# EAGLE design escape_uno (EAGLE 9.5.1)
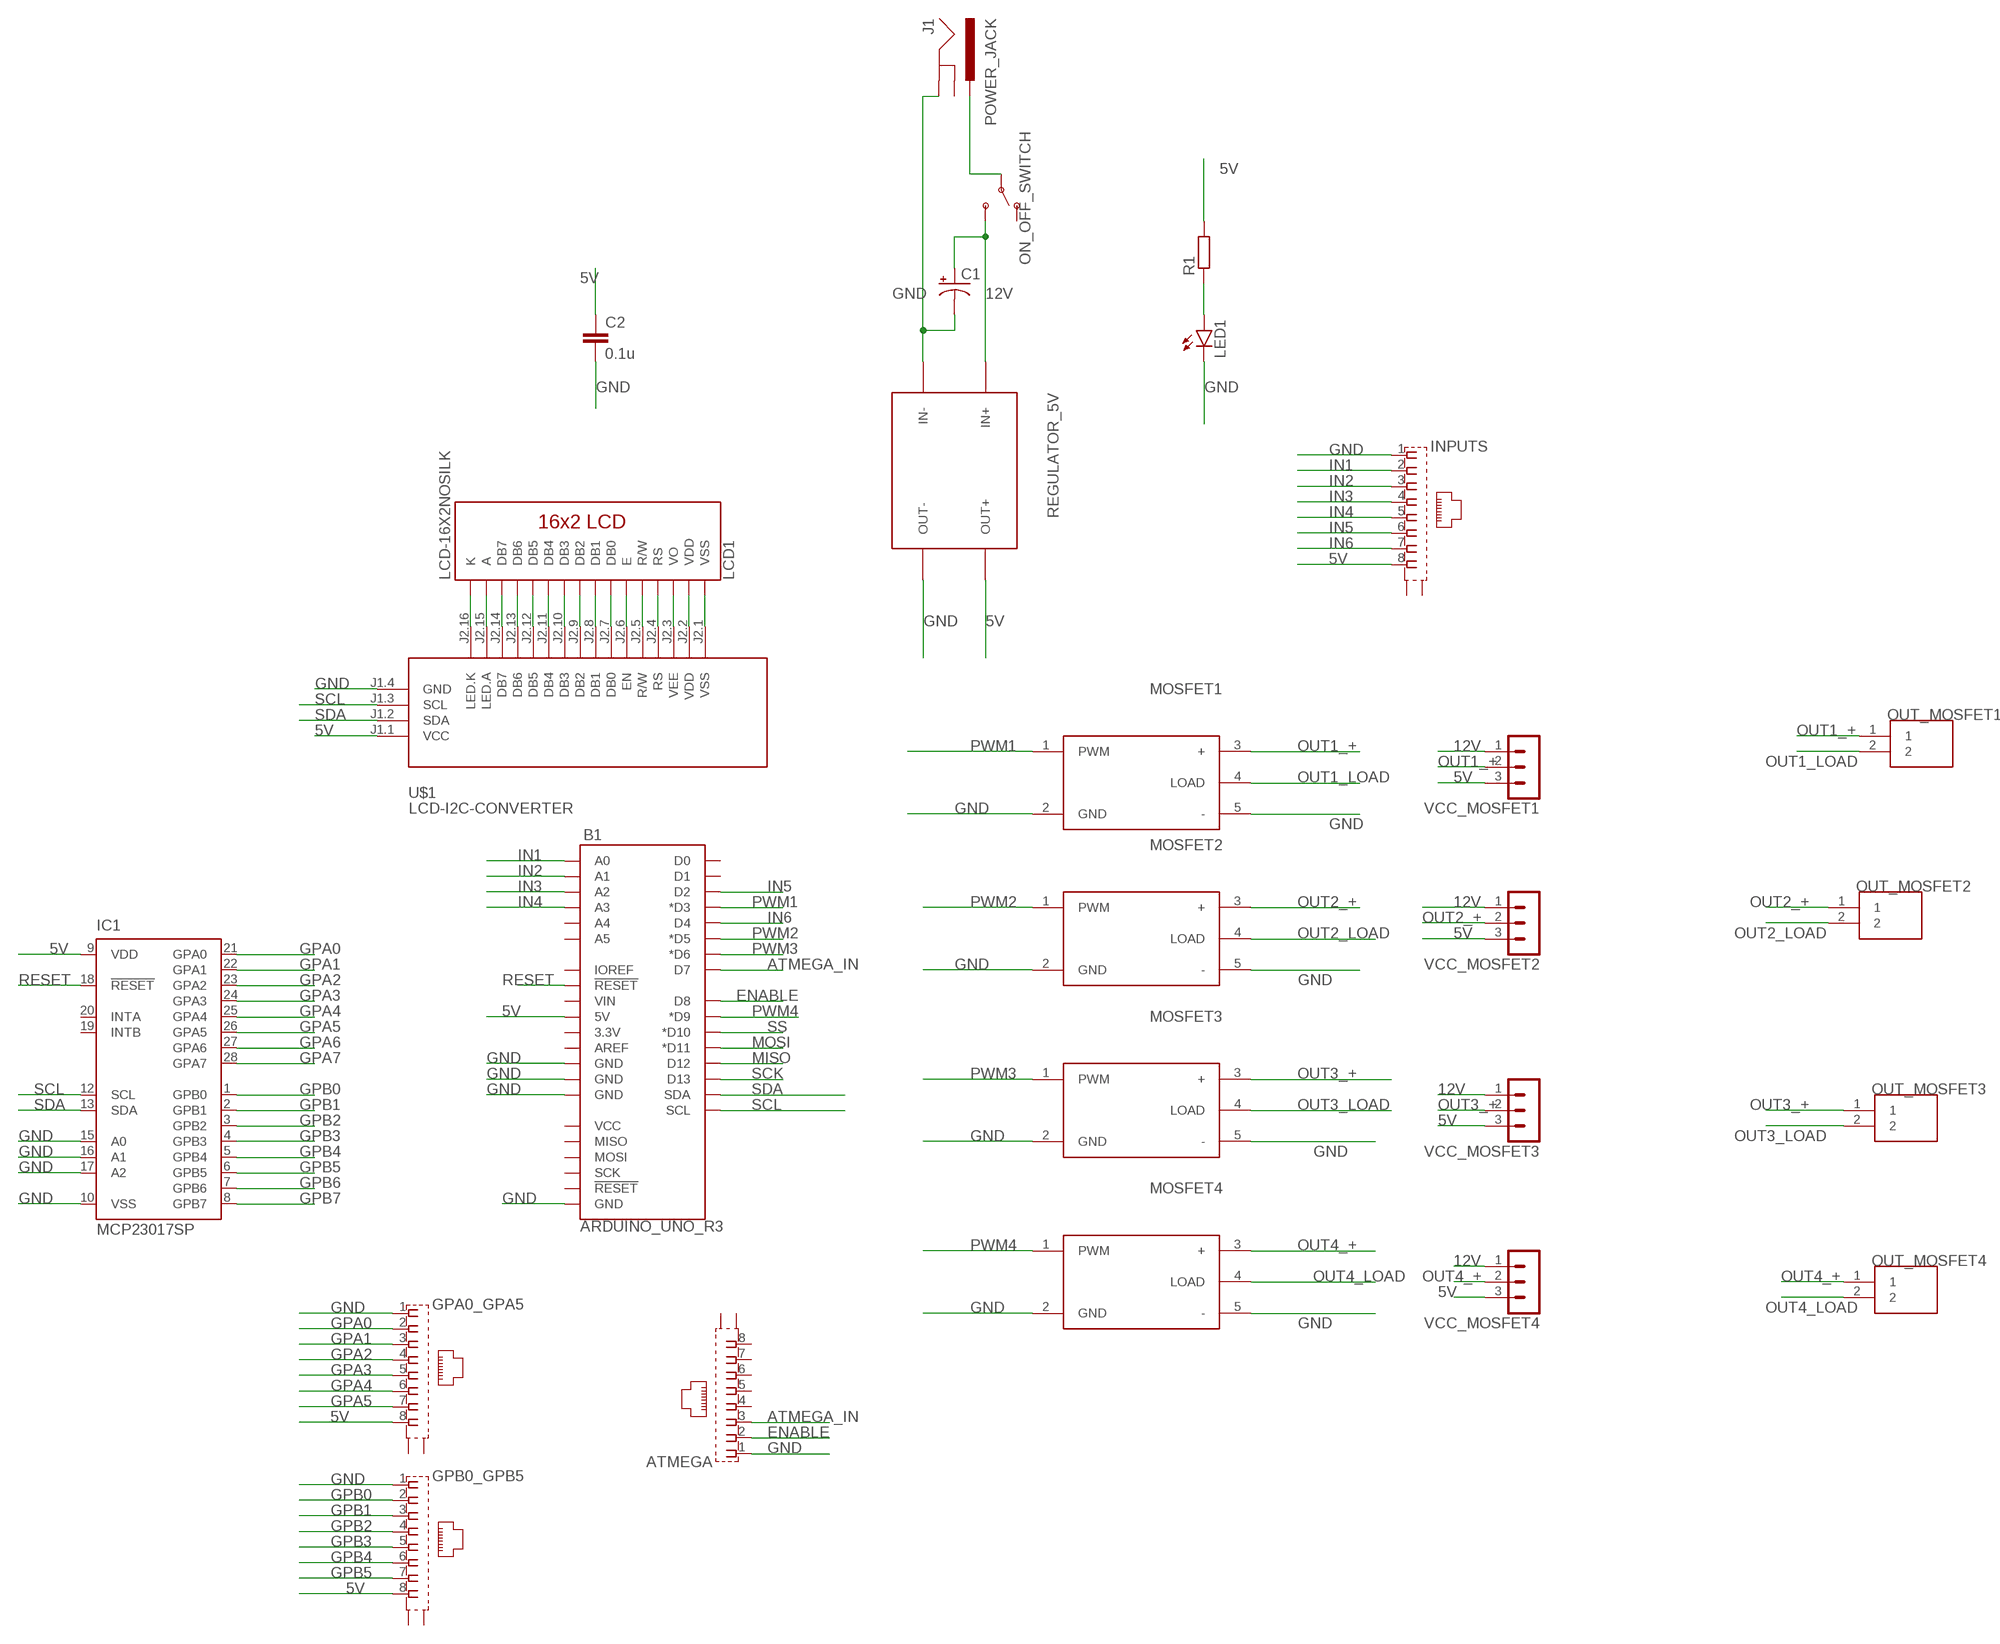
[diagram p0: schematic, sheet 1]

## Parts
ATMEGA  GLX-S-88M  [GLX-S-88M]
B1  ARDUINO_UNO_R3  [ARDUINO_R3]
C1  CPOL-USB45181C  [B45181C]
C2  0.1u  C-EU025-025X050  [C025-025X050]
GPA0_GPA5  GLX-S-88M  [GLX-S-88M]
GPB0_GPB5  GLX-S-88M  [GLX-S-88M]
IC1  MCP23017SP  [DIL28-3]
INPUTS  GLX-S-88M  [GLX-S-88M]
J1  POWER_JACK  [POWER_JACK_PTH]
LCD1  LCD-16X2NOSILK  [LCD-16X2_NOSILK]
LED1  LED5MM  [LED5MM]
MOSFET1  SAMACSYS_PARTS_FR120N-ISOLATED-MOSFET-MOD  [SAMACSYS_PARTS_FR120N-ISOLATED-MOSFET-MOD]
MOSFET2  SAMACSYS_PARTS_FR120N-ISOLATED-MOSFET-MOD  [SAMACSYS_PARTS_FR120N-ISOLATED-MOSFET-MOD]
MOSFET3  SAMACSYS_PARTS_FR120N-ISOLATED-MOSFET-MOD  [SAMACSYS_PARTS_FR120N-ISOLATED-MOSFET-MOD]
MOSFET4  SAMACSYS_PARTS_FR120N-ISOLATED-MOSFET-MOD  [SAMACSYS_PARTS_FR120N-ISOLATED-MOSFET-MOD]
ON_OFF_SWITCH  SWITCH-SPDT-PTH-11.6X4.0MM-SHORT_LEADS  [SWITCH_SPDT_PTH_11.6X4.0MM]
OUT_MOSFET1  TB006-508-02BE_TB006-508-02BE  [TB006-508-02BE_CUI_TB006-508-02BE]
OUT_MOSFET2  TB006-508-02BE_TB006-508-02BE  [TB006-508-02BE_CUI_TB006-508-02BE]
OUT_MOSFET3  TB006-508-02BE_TB006-508-02BE  [TB006-508-02BE_CUI_TB006-508-02BE]
OUT_MOSFET4  TB006-508-02BE_TB006-508-02BE  [TB006-508-02BE_CUI_TB006-508-02BE]
R1  R-EU_0207/10  [0207/10]
REGULATOR_5V  DIY-MODULES_DC-DC-STEP-DOWN-LM2596  [DIY-MODULES_DC-DC-STEP-DOWN-LM2596]
U$1  LCD-I2C-CONVERTER  [LCD-I2C-CONVERTER]
VCC_MOSFET1  MA03-1  [MA03-1]
VCC_MOSFET2  MA03-1  [MA03-1]
VCC_MOSFET3  MA03-1  [MA03-1]
VCC_MOSFET4  MA03-1  [MA03-1]

## Nets
5V: B1.5V C2.1 GPA0_GPA5.8 GPB0_GPB5.8 IC1.9(VDD) INPUTS.8 R1.2 REGULATOR_5V.OUT+ U$1.J1.1(VCC) VCC_MOSFET1.3 VCC_MOSFET2.3 VCC_MOSFET3.3 VCC_MOSFET4.3
12V: C1.+ ON_OFF_SWITCH.3(S) REGULATOR_5V.IN+ VCC_MOSFET1.1 VCC_MOSFET2.1 VCC_MOSFET3.1 VCC_MOSFET4.1
ATMEGA_IN: ATMEGA.3 B1.D7
ENABLE: ATMEGA.2 B1.D8
GND: ATMEGA.1 B1.GND@1(GND) B1.GND@2(GND) B1.GND@3(GND) B1.GND@4(GND) C1.- C2.2 GPA0_GPA5.1 GPB0_GPB5.1 IC1.10(VSS) IC1.15(A0) IC1.16(A1) IC1.17(A2) INPUTS.1 J1.GND LED1.K(C) MOSFET1.2(GND) MOSFET1.5(-) MOSFET2.2(GND) MOSFET2.5(-) MOSFET3.2(GND) MOSFET3.5(-) MOSFET4.2(GND) MOSFET4.5(-) REGULATOR_5V.IN- REGULATOR_5V.OUT- U$1.J1.4(GND)
GPA0: GPA0_GPA5.2 IC1.21(GPA0)
GPA1: GPA0_GPA5.3 IC1.22(GPA1)
GPA2: GPA0_GPA5.4 IC1.23(GPA2)
GPA3: GPA0_GPA5.5 IC1.24(GPA3)
GPA4: GPA0_GPA5.6 IC1.25(GPA4)
GPA5: GPA0_GPA5.7 IC1.26(GPA5)
GPA6: IC1.27(GPA6)
GPA7: IC1.28(GPA7)
GPB0: GPB0_GPB5.2 IC1.1(GPB0)
GPB1: GPB0_GPB5.3 IC1.2(GPB1)
GPB2: GPB0_GPB5.4 IC1.3(GPB2)
GPB3: GPB0_GPB5.5 IC1.4(GPB3)
GPB4: GPB0_GPB5.6 IC1.5(GPB4)
GPB5: GPB0_GPB5.7 IC1.6(GPB5)
GPB6: IC1.7(GPB6)
GPB7: IC1.8(GPB7)
IN1: B1.A0 INPUTS.2
IN2: B1.A1 INPUTS.3
IN3: B1.A2 INPUTS.4
IN4: B1.A3 INPUTS.5
IN5: B1.D2 INPUTS.6
IN6: B1.D4 INPUTS.7
MISO: B1.D12
MOSI: B1.D11(*D11)
N$1: J1.PWR ON_OFF_SWITCH.2(P)
N$2: LED1.A R1.1
N$11: LCD1.16(K) U$1.J2.16(LED.K)
N$12: LCD1.15(A) U$1.J2.15(LED.A)
N$13: LCD1.14(DB7) U$1.J2.14(DB7)
N$14: LCD1.13(DB6) U$1.J2.13(DB6)
N$24: LCD1.12(DB5) U$1.J2.12(DB5)
N$25: LCD1.11(DB4) U$1.J2.11(DB4)
N$26: LCD1.10(DB3) U$1.J2.10(DB3)
N$27: LCD1.9(DB2) U$1.J2.9(DB2)
N$28: LCD1.8(DB1) U$1.J2.8(DB1)
N$29: LCD1.7(DB0) U$1.J2.7(DB0)
N$30: LCD1.6(E) U$1.J2.6(EN)
N$31: LCD1.5(R/W) U$1.J2.5(R/W)
N$32: LCD1.4(RS) U$1.J2.4(RS)
N$33: LCD1.3(VO) U$1.J2.3(VEE)
N$34: LCD1.2(VDD) U$1.J2.2(VDD)
N$35: LCD1.1(VSS) U$1.J2.1(VSS)
OUT1_+: MOSFET1.3(+) OUT_MOSFET1.1 VCC_MOSFET1.2
OUT1_LOAD: MOSFET1.4(LOAD) OUT_MOSFET1.2
OUT2_+: MOSFET2.3(+) OUT_MOSFET2.1 VCC_MOSFET2.2
OUT2_LOAD: MOSFET2.4(LOAD) OUT_MOSFET2.2
OUT3_+: MOSFET3.3(+) OUT_MOSFET3.1 VCC_MOSFET3.2
OUT3_LOAD: MOSFET3.4(LOAD) OUT_MOSFET3.2
OUT4_+: MOSFET4.3(+) OUT_MOSFET4.1 VCC_MOSFET4.2
OUT4_LOAD: MOSFET4.4(LOAD) OUT_MOSFET4.2
PWM1: B1.D3(*D3) MOSFET1.1(PWM)
PWM2: B1.D5(*D5) MOSFET2.1(PWM)
PWM3: B1.D6(*D6) MOSFET3.1(PWM)
PWM4: B1.D9(*D9) MOSFET4.1(PWM)
RESET: B1.RESET@1(!RESET!) IC1.18(!RESET)
SCK: B1.D13
SCL: B1.SCL IC1.12(SCL) U$1.J1.3(SCL)
SDA: B1.SDA IC1.13(SDA) U$1.J1.2(SDA)
SS: B1.D10(*D10)
Unconnected: ATMEGA.4 ATMEGA.5 ATMEGA.6 ATMEGA.7 ATMEGA.8 ATMEGA.S1 ATMEGA.S2 B1.3.3V B1.A4 B1.A5 B1.AREF B1.D0 B1.D1 B1.IOREF B1.MISO B1.MOSI B1.RESET@2(!RESET!) B1.SCK B1.VCC B1.VIN GPA0_GPA5.S1 GPA0_GPA5.S2 GPB0_GPB5.S1 GPB0_GPB5.S2 IC1.19(INTB) IC1.20(INTA) INPUTS.S1 INPUTS.S2 J1.GNDBREAK ON_OFF_SWITCH.1(O)

## Library data of the parts
ATMEGA GPA0_GPA5 GPB0_GPB5 INPUTS = con-kycon:GLX-S-88M: Mod. Jack, Right Angle, 8 posiotion, 8 contatcs RJ45 Source: GLX-S-88M.pdf; OC_FARNELL: unknown; OC_NEWARK: unknown
B1 = SparkFun-Boards:ARDUINO_UNO_R3: Arduino R3 Footprint with SPI header Arduino Uno R3 Compatible Footprint. Matches PCB size of the original board. SparkFun Products: SAMD21 Dev Breakout <https://www.sparkfun.com/products/13672> RedBoard <https://www.sparkfun.com/products/12757> R3 Stackable Headers <https://www.sparkfun.com/products/11417>
C1 = rcl:CPOL-US: POLARIZED CAPACITOR, American symbol; SPICEPREFIX: C
C2 = rcl:C-EU: CAPACITOR, European symbol; SPICEPREFIX: C
IC1 = microchip:MCP23017: http://ww1.microchip.com/downloads/en/DeviceDoc/21952a.pdf Source: http://ww1.microchip.com/downloads/en/DeviceDoc/21952a.pdf; MF: MICROCHIP; MPN: MCP23017-E/SP; OC_FARNELL: 1332088; OC_NEWARK: 31K2959
J1 = SparkFun-Connectors:POWER_JACK: Power Jack Connector This is the standard 5.5mm barrel jack for power. The PTH is the most common, proven, reliable, footprint. The Slot footprint only works if the mill layer is transmitted to the PCB fab house so be warned. Here are the connectors we sell at SparkFun: DC Barrel Power Jack/Connector <https://www.sparkfun.com/products/119> (PRT-00119) DC Barrel Power Jack/Connector (SMD) <https://www.sparkfun.com/products/12748> (PRT-12748) DC Barrel Jack Adapter - Breadboard Compatible <https://www.sparkfun.com/products/10811> (PRT-10811) It is used on this SparkFun product (and many, many others): SparkFun RedBoard - Programmed with Arduino <https://www.sparkfun.com/products/12757> (DEV-12757) Also, if you need a mating power supply or connector, please check these out: Wall Adapter Power Supply - 9VDC 650mA <https://www.sparkfun.com/products/298> (TOL-00298) DC Barrel Jack Adapter - Male <https://www.sparkfun.com/products/10287> (PRT-10287); PROD_ID: CONN-08197
LCD1 = SparkFun-Displays:LCD-16X2: Standard text-only 16x2 parallel input LCD Basic 16 character by 2 line display. Typically utilizes the extremely common HD44780 parallel interface chipset SparkFun Products: Basic 16x2 Green <https://www.sparkfun.com/products/255> Basic 8x2 Green <https://www.sparkfun.com/products/11122>; SF_ID: LCD-00255
LED1 = led:LED: LED OSRAM: - CHIPLED LG R971, LG N971, LY N971, LG Q971, LY Q971, LO R971, LY R971 LH N974, LH R974 LS Q976, LO Q976, LY Q976 LO Q996 - Hyper CHIPLED LW Q18S LB Q993, LB Q99A, LB R99A - SideLED LS A670, LO A670, LY A670, LG A670, LP A670 LB A673, LV A673, LT A673, LW A673 LH A674 LY A675 LS A676, LA A676, LO A676, LY A676, LW A676 LS A679, LY A679, LG A679 - Hyper Micro SIDELED® LS Y876, LA Y876, LO Y876, LY Y876 LT Y87S - SmartLED LW L88C, LW L88S LB L89C, LB L89S, LG L890 LS L89K, LO L89K, LY L89K LS L896, LA L896, LO L896, LY L896 - TOPLED LS T670, LO T670, LY T670, LG T670, LP T670 LSG T670, LSP T670, LSY T670, LOP T670, LYG T670 LG T671, LOG T671, LSG T671 LB T673, LV T673, LT T673, LW T673 LH T674 LS T676, LA T676, LO T676, LY T676, LB T676, LH T676, LSB T676, LW T676 LB T67C, LV T67C, LT T67C, LS T67K, LO T67K, LY T67K, LW E67C LS E67B, LA E67B, LO E67B, LY E67B, LB E67C, LV E67C, LT E67C LW T67C LS T679, LY T679, LG T679 LS T770, LO T770, LY T770, LG T770, LP T770 LB T773, LV T773, LT T773, LW T773 LH T774 LS E675, LA E675, LY E675, LS T675 LS T776, LA T776, LO T776, LY T776, LB T776 LHGB T686 LT T68C, LB T68C - Hyper Mini TOPLED® LB M676 - Mini TOPLED Santana® LG M470 LS M47K, LO M47K, LY M47K Source: http://www.osram.convergy.de LUXEON: - LUMILED® LXK2-PW12-R00, LXK2-PW12-S00, LXK2-PW14-U00, LXK2-PW14-V00 LXK2-PM12-R00, LXK2-PM12-S00, LXK2-PM14-U00 LXK2-PE12-Q00, LXK2-PE12-R00, LXK2-PE12-S00, LXK2-PE14-T00, LXK2-PE14-U00 LXK2-PB12-K00, LXK2-PB12-L00, LXK2-PB12-M00, LXK2-PB14-N00, LXK2-PB14-P00, LXK2-PB14-Q00 LXK2-PR12-L00, LXK2-PR12-M00, LXK2-PR14-Q00, LXK2-PR14-R00 LXK2-PD12-Q00, LXK2-PD12-R00, LXK2-PD12-S00 LXK2-PH12-R00, LXK2-PH12-S00 LXK2-PL12-P00, LXK2-PL12-Q00, LXK2-PL12-R00 Source: www.luxeon.com KINGBRIGHT: KA-3528ASYC Source: www.kingbright.com
MOSFET1-MOSFET4 = palames:SAMACSYS_PARTS_FR120N-ISOLATED-MOSFET-MOD
ON_OFF_SWITCH = SparkFun-Switches:SWITCH-SPDT: Single Pole, Double Throw (SPDT) Switch Single-pole, double-throw (SPDT) switch. Variant Overview SMD-AYZ0202 Surface Mount DPDT Switch <https://www.sparkfun.com/products/597> (COM-00597) Used on e.g. LilyPad Arduino USB - ATmega32U4 Board <https://www.sparkfun.com/products/12049> PTH-11.6X4.0MM SPDT Mini Power Switch <https://www.sparkfun.com/products/102> (COM-00102) Used on e.g. SparkFun Simon Says - Through-Hole Soldering Kit <https://www.sparkfun.com/products/10547> (KIT-10547) PTH-11.6X4.0MM-KIT KIT version of SPDT Mini Power Switch - Simplifies soldering by removing tStop of switch pins - only one side can be soldered. PTH-11.6X4.0MM-LOCK LOCK version of SPDT Mini Power Switch - Offset pins hold switch in place for easier soldering. SMD-RIGHT-ANGLE Surface Mount Right Angle Switch <https://www.sparkfun.com/products/10860> (COM-10860) Used on e.g. SparkFun ESP8266 Thing <https://www.sparkfun.com/products/13231>; PROD_ID: SWCH-13151
OUT_MOSFET1-OUT_MOSFET4 = palames:TB006-508-02BE_TB006-508-02BE; AVAILABILITY: Unavailable; CUI_PURCHASE_URL: https://www.cuidevices.com/product/interconnect/connectors/terminal-blocks/tb006-508-series?utm_source=snapeda.com&utm_medium=referral&utm_campaign=snapedaBOM; DESCRIPTION: 2~24 Poles, Screw Type, Horizontal, 5.08 Pitch, 26~14 _AWG_, Terminal Block Connector; MF: CUI Devices; MP: TB006-508-02BE; PACKAGE: None; PRICE: None
R1 = rcl:R-EU_: RESISTOR, European symbol; SPICEPREFIX: R
REGULATOR_5V = palames:DIY-MODULES_DC-DC-STEP-DOWN-LM2596: DC/DC Step-Down Regulator based on LM2596-ADJ chip LM2596 datasheet available here: http://www.ti.com/lit/ds/symlink/lm2596.pdf Click here to find device on ebay.com <http://www.ebay.com/sch/lm2596+power+regulator>
U$1 = diy-modules:LCD-I2C-CONVERTER: I2C Bus to 4-Bit Parallel LCD Interface with LED backlight driver
VCC_MOSFET1-VCC_MOSFET4 = con-lstb:MA03-1: PIN HEADER; OC_FARNELL: unknown; OC_NEWARK: unknown

## Board
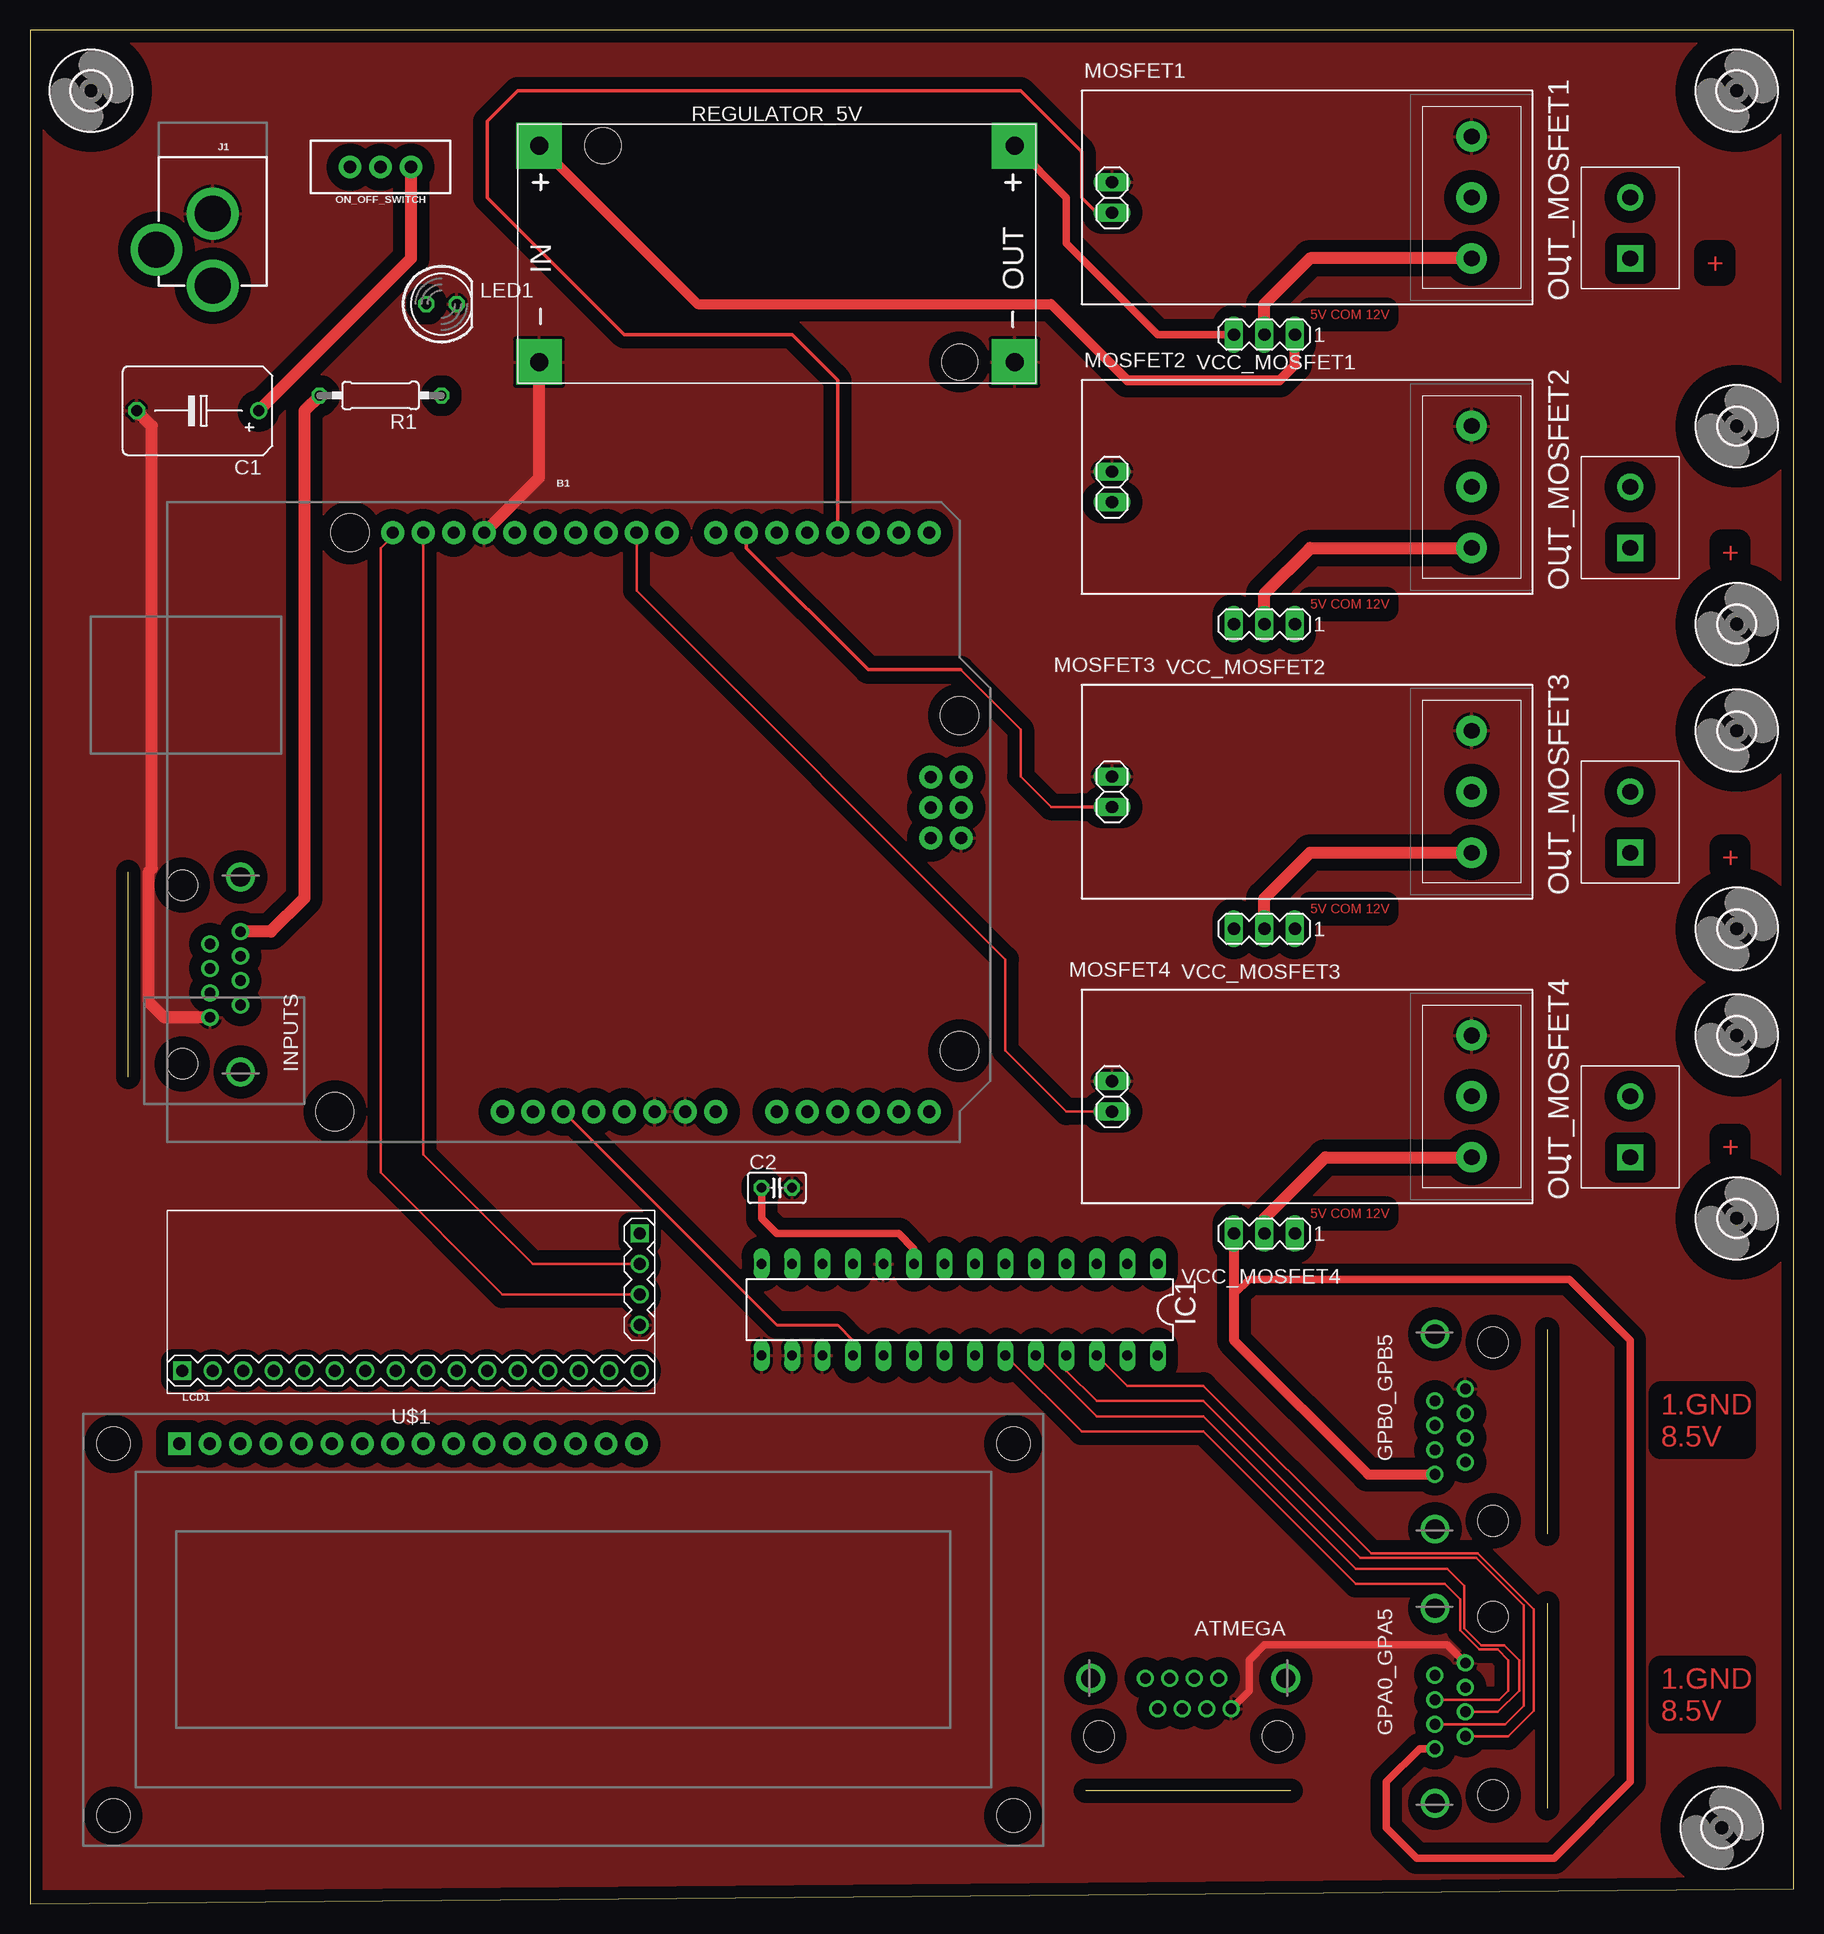
[diagram p1: board, top side]
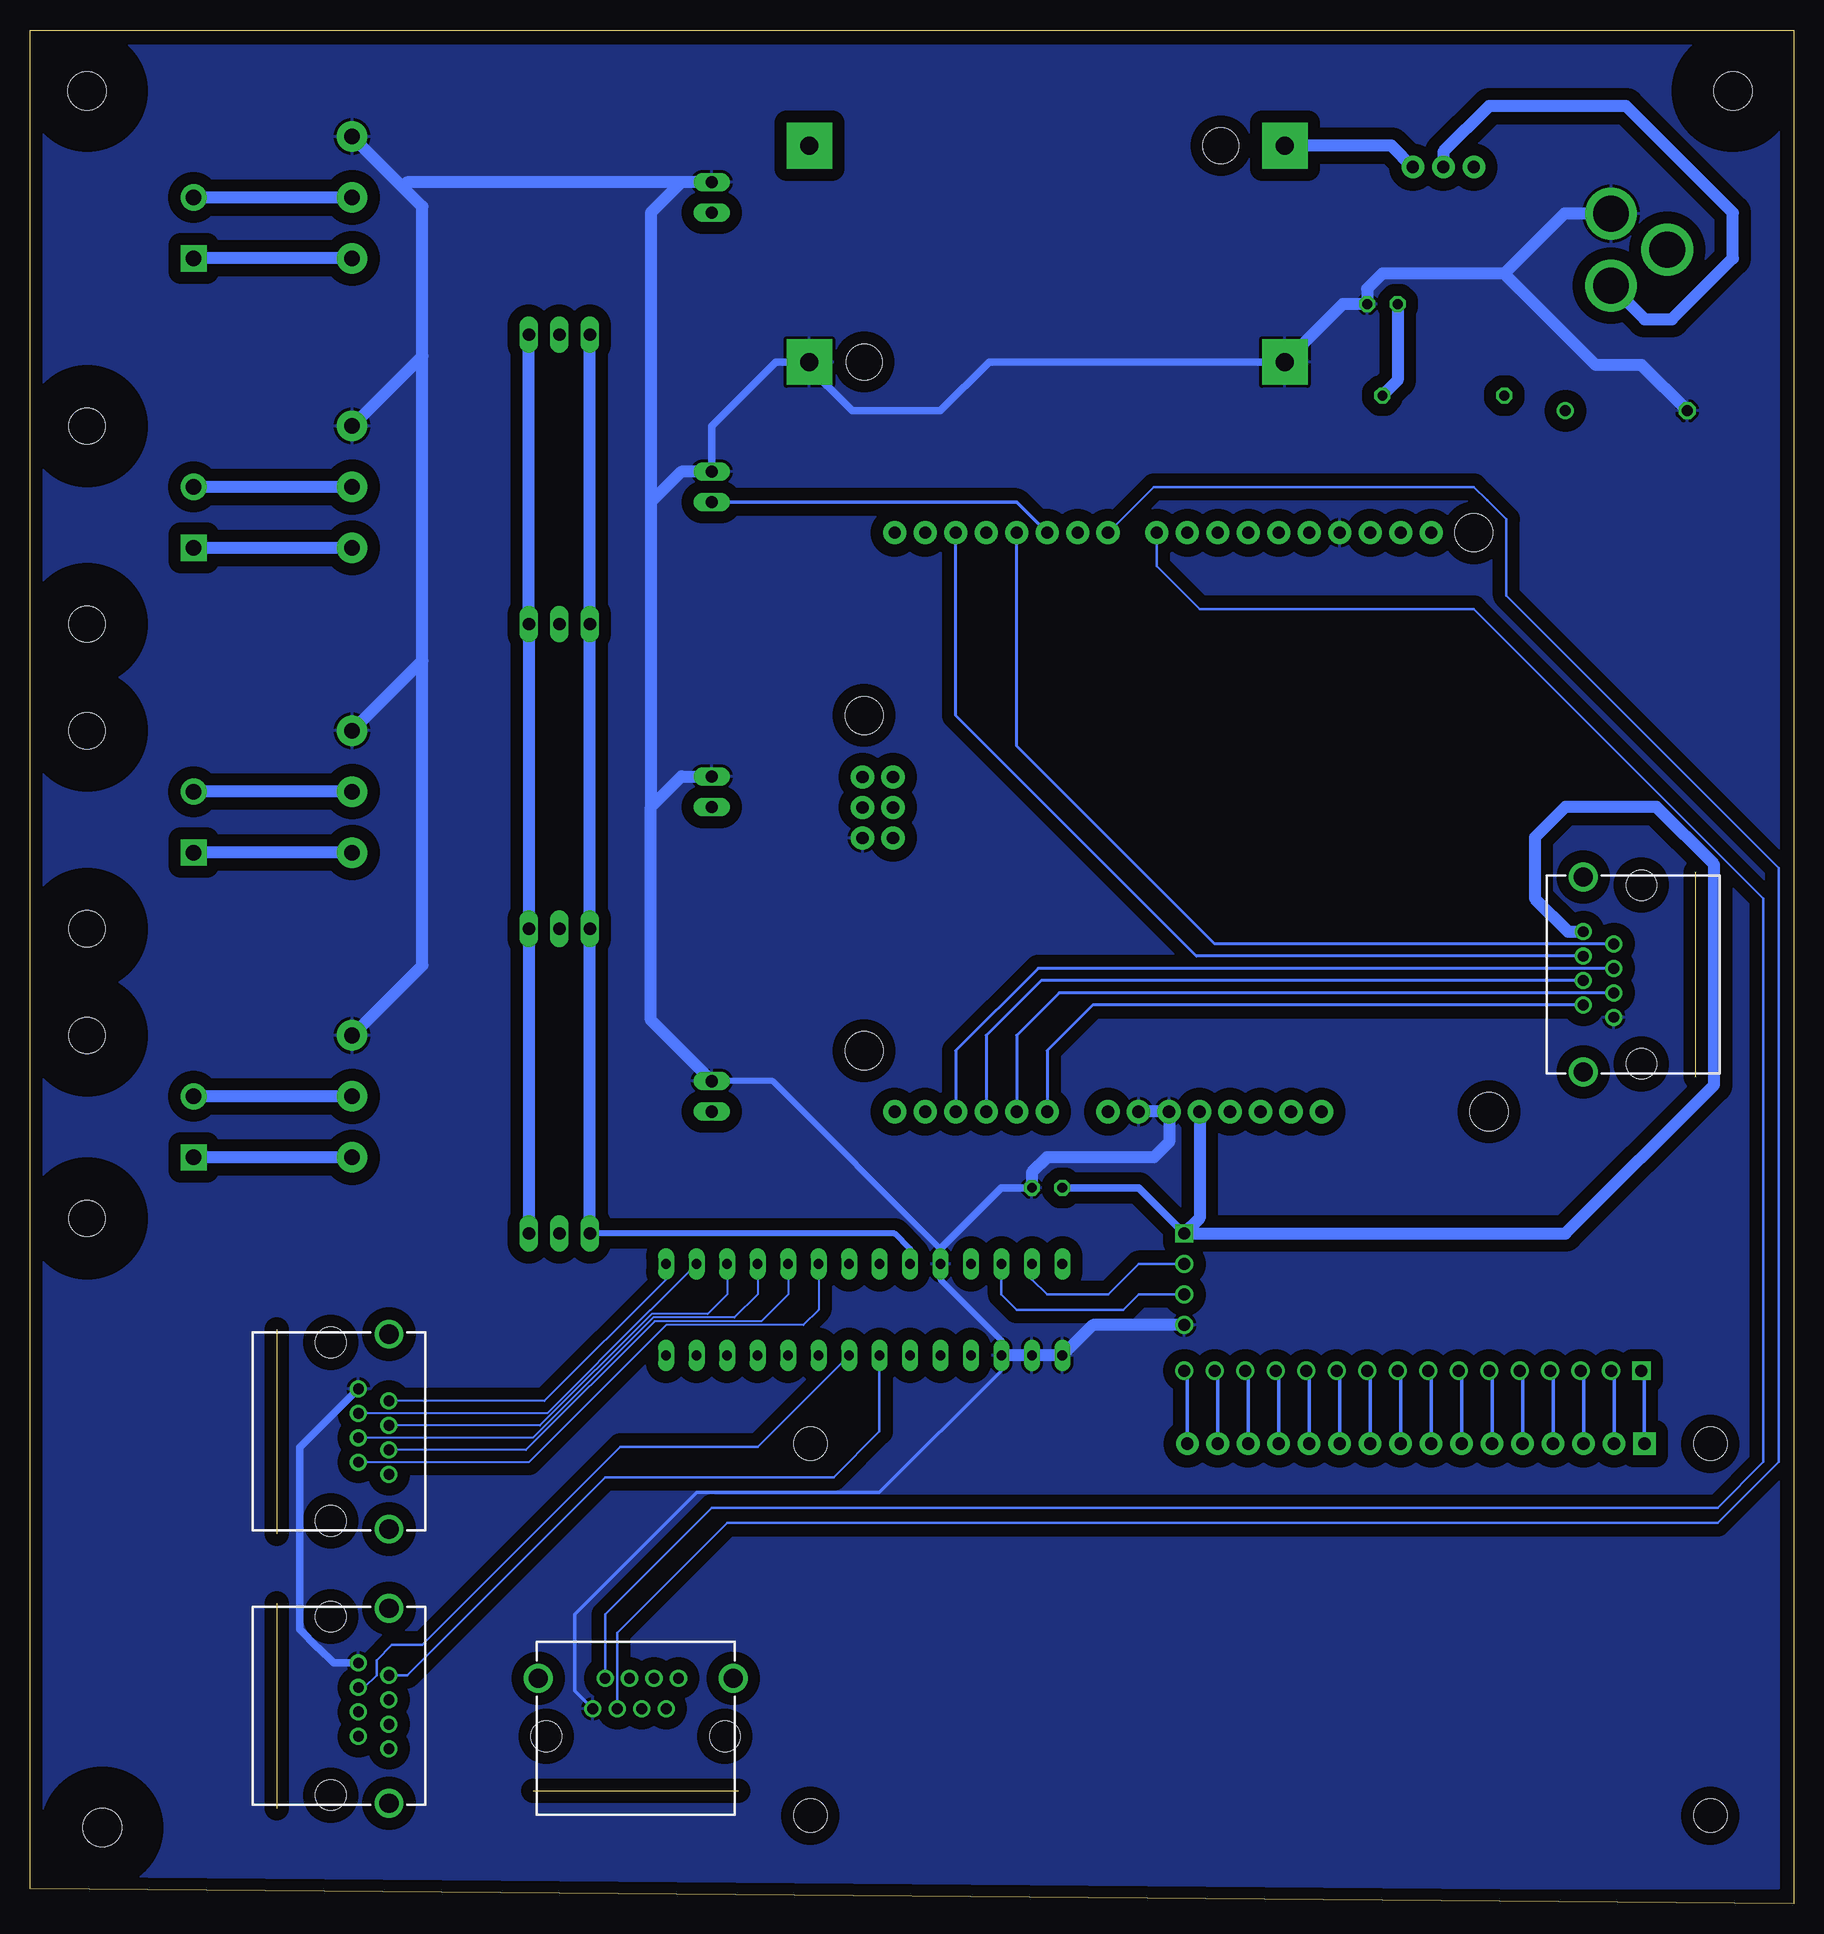
[diagram p2: board, bottom side, seen from below]

Size 146.99 x 156.2 mm. Coordinates in mm from the lower left corner, seen from the top.
Outline: 0,0 146.99,1.27 146.99,156.2 0,156.2 0,0
Copper layers (1*16): Top 0.035mm / dielectric 1.5mm / Bottom 0.035mm
Design rules "default": minimum track width 6mil, minimum drill 0.35mm, track to track 6mil, track to pad 6mil, pad to pad 6mil, via to via 6mil, smd to smd 6mil, copper to edge 40mil, drill to drill 6mil, minimum pad ring 10mil, minimum via ring 8mil, stop-mask expansion 4mil, vias tented up to drill 0mil, thermal gap 10mil

### Footprints (pad centres in the part's own frame; a part is rotated, then mirrored left to right if it is on the bottom)
GLX-S-88M = drill 0.9 pad 1.422: 1 -3.57,-2.3; 2 -2.55,-4.84; 3 -1.53,-2.3; 4 -0.51,-4.84; 5 0.51,-2.3; 6 1.53,-4.84; 7 2.55,-2.3; 8 3.57,-4.84 | drill 1.6 pad 2.184: S1 -8.125,-4.84; S2 8.125,-4.84 | hole 2.55: -7.44,0; 7.44,0
ARDUINO_R3 = drill 1.016 pad 1.93: 3.3V 2.54,-24.13; 5V 5.08,-24.13; A0 17.78,-24.13; A1 20.32,-24.13; A2 22.86,-24.13; A3 25.4,-24.13; A4 27.94,-24.13; A5 30.48,-24.13; AREF -9.144,24.13; D0 30.48,24.13; D1 27.94,24.13; D2 25.4,24.13; D3 22.86,24.13; D4 20.32,24.13; D5 17.78,24.13; D6 15.24,24.13; D7 12.7,24.13; D8 8.636,24.13; D9 6.096,24.13; D10 3.556,24.13; D11 1.016,24.13; D12 -1.524,24.13; D13 -4.064,24.13; GND@1 7.62,-24.13; GND@2 10.16,-24.13; GND@3 -6.604,24.13; GND@4 33.16,-1.32; IOREF -2.54,-24.13; MISO 30.62,3.76; MOSI 33.16,1.22; NC -5.08,-24.13; RESET@1 0,-24.13; RESET@2 30.62,-1.32; SCK 30.62,1.22; SCL -14.224,24.13; SDA -11.684,24.13; VCC 33.16,3.76; VIN 12.7,-24.13 | hole 3.175: -17.78,24.13; 33.02,8.89; 33.02,-19.05; -19.05,-24.13
B45181C = drill 0.914: + -5.08,0 | drill 0.914 octagon: - 5.08,0
C025-025X050 = drill 0.813 octagon: 1 -1.27,0; 2 1.27,0
DIL28-3 = drill 0.813 long: 1 -16.51,-3.81; 2 -13.97,-3.81; 3 -11.43,-3.81; 4 -8.89,-3.81; 5 -6.35,-3.81; 6 -3.81,-3.81; 7 -1.27,-3.81; 8 1.27,-3.81; 9 3.81,-3.81; 10 6.35,-3.81; 11 8.89,-3.81; 12 11.43,-3.81; 13 13.97,-3.81; 14 16.51,-3.81; 15 16.51,3.81; 16 13.97,3.81; 17 11.43,3.81; 18 8.89,3.81; 19 6.35,3.81; 20 3.81,3.81; 21 1.27,3.81; 22 -1.27,3.81; 23 -3.81,3.81; 24 -6.35,3.81; 25 -8.89,3.81; 26 -11.43,3.81; 27 -13.97,3.81; 28 -16.51,3.81
POWER_JACK_PTH = drill 2.997 pad 4.318: GND 0,7.7; GNDBREAK 4.7,10.7; PWR 0,13.7
LCD-16X2_NOSILK = drill 1.016 pad 1.88 square: 1 -32,15.5 | drill 1.016 pad 1.88: 2 -29.46,15.5; 3 -26.92,15.5; 4 -24.38,15.5; 5 -21.84,15.5; 6 -19.3,15.5; 7 -16.76,15.5; 8 -14.22,15.5; 9 -11.68,15.5; 10 -9.14,15.5; 11 -6.6,15.5; 12 -4.06,15.5; 13 -1.52,15.5; 14 1.02,15.5; 15 3.56,15.5; 16 6.1,15.5 | hole 2.8: -37.5,15.5; -37.5,-15.5; 37.5,15.5; 37.5,-15.5
LED5MM = drill 0.813 octagon: A -1.27,0; K 1.27,0
SAMACSYS_PARTS_FR120N-ISOLATED-MOSFET-MOD = drill 1.016 long: 1 2.54,7.62; 2 2.54,10.16 | drill 1.3 pad 2.54: 3 32.512,3.81; 4 32.512,8.89; 5 32.512,13.97
SWITCH_SPDT_PTH_11.6X4.0MM = drill 1.016 pad 1.88: 1 0,2.54; 2 0,0; 3 0,-2.54
TB006-508-02BE_CUI_TB006-508-02BE = drill 1.3 pad 2.184 square: 1 0,0 | drill 1.3 pad 2.184: 2 5.08,0
0207/10 = drill 0.813 octagon: 1 -5.08,0; 2 5.08,0
DIY-MODULES_DC-DC-STEP-DOWN-LM2596 = drill 1.5 pad 3.81 square: IN+ -19.812,9.398; IN- -19.812,-8.636; OUT+ 19.812,9.398; OUT- 19.812,-8.636 | hole 3: -14.478,9.398; 15.24,-8.636
LCD-I2C-CONVERTER = drill 1 square: J1.1 -19.05,-5.08; J2.1 19.05,6.35 | drill 1: J1.2 -19.05,-2.54; J1.3 -19.05,0; J1.4 -19.05,2.54; J2.2 16.51,6.35; J2.3 13.97,6.35; J2.4 11.43,6.35; J2.5 8.89,6.35; J2.6 6.35,6.35; J2.7 3.81,6.35; J2.8 1.27,6.35; J2.9 -1.27,6.35; J2.10 -3.81,6.35; J2.11 -6.35,6.35; J2.12 -8.89,6.35; J2.13 -11.43,6.35; J2.14 -13.97,6.35; J2.15 -16.51,6.35; J2.16 -19.05,6.35
3,0 = hole 3: 0,0
3,2 = hole 3.2: 0,0
MA03-1 = drill 1.016 long: 1 -2.54,0; 2 0,0; 3 2.54,0

### Placement (x,y rotation side)
ATMEGA  96.52,13.97 180 top
B1  44.45,90.17 0 top
C1  13.97,124.46 180 top
C2  62.23,59.69 0 top
GPA0_GPA5  121.92,16.51 270 top
GPB0_GPB5  121.92,39.37 270 top
IC1  77.47,49.53 180 top
INPUTS  12.7,77.47 90 top
J1  15.24,148.59 180 top
LCD1  44.45,22.86 0 top
LED1  34.29,133.35 0 top
MOSFET1  87.63,133.35 0 top
MOSFET2  87.63,109.22 0 top
MOSFET3  87.63,83.82 0 top
MOSFET4  87.63,58.42 0 top
ON_OFF_SWITCH  29.21,144.78 90 top
OUT_MOSFET1  133.35,137.16 90 top
OUT_MOSFET2  133.35,113.03 90 top
OUT_MOSFET3  133.35,87.63 90 top
OUT_MOSFET4  133.35,62.23 90 top
R1  29.21,125.73 180 top
REGULATOR_5V  62.23,137.16 0 top
U$1  31.75,50.8 180 top
U$2  [3,0]  142.24,97.79 0 top
U$3  [3,0]  142.24,81.28 0 top
U$4  [3,0]  142.24,123.19 0 top
U$5  [3,0]  142.24,106.68 0 top
U$6  [3,0]  142.24,57.15 0 top
U$7  [3,0]  142.24,72.39 0 top
U$9  [3,2]  142.24,151.13 0 top
U$10  [3,2]  5.08,151.13 0 top
U$11  [3,2]  140.97,6.35 0 top
VCC_MOSFET1  102.87,130.81 180 top
VCC_MOSFET2  102.87,106.68 180 top
VCC_MOSFET3  102.87,81.28 180 top
VCC_MOSFET4  102.87,55.88 180 top

### Tracks (layer width: path | path; a pad name or v marks a point on that pad's centre or on a via)
5V
  Top 0.61: REGULATOR_5V.OUT+ 86.36,142.24 86.36,138.43 93.98,130.81 VCC_MOSFET1.3 | IC1.9 73.66,54.61 72.39,55.88 62.23,55.88 60.96,57.15 C2.1 | GPA0_GPA5.8 115.81,12.94 113.03,10.16 113.03,6.35 115.57,3.81 127,3.81 133.35,10.16 133.35,46.99 128.27,52.07 101.6,52.07 100.33,50.8
  Top 0.813: VCC_MOSFET4.3 100.33,50.8 100.33,46.99 111.52,35.8 GPB0_GPB5.8
  Top 1.016: R1.2 22.86,124.46 22.86,83.82 20.08,81.04 INPUTS.8
  Bottom 0.508: IC1.9 73.66,54.61 74.93,55.88 VCC_MOSFET4.3
  Bottom 0.61: U$1.J1.1 54.61,59.69 C2.1
  Bottom 1.016: VCC_MOSFET1.3 VCC_MOSFET2.3 VCC_MOSFET3.3 VCC_MOSFET4.3 | INPUTS.8 18.81,81.04 21.59,83.82 21.59,88.9 19.05,91.44 11.46,91.44 6.66,86.63 6.66,68.27 19.05,55.88 U$1.J1.1 49.53,57.15 B1.5V
12V
  Top 0.813: REGULATOR_5V.IN+ 55.63,133.35 85.09,133.35 91.44,127 104.14,127 105.41,128.27 VCC_MOSFET1.1
  Top 1.016: C1.+ 31.75,137.16 ON_OFF_SWITCH.3
  Bottom 1.016: VCC_MOSFET4.1 VCC_MOSFET3.1 VCC_MOSFET2.1 VCC_MOSFET1.1 | ON_OFF_SWITCH.3 33.53,146.56 REGULATOR_5V.IN+
ATMEGA_IN
  Bottom 0.203: ATMEGA.3 98.05,22.6 88.9,31.75 6.35,31.75 1.27,36.83 1.27,86.36 23.97,109.06 23.97,115.42 25.55,117.01 25.56,117.01 26.67,118.11 53.34,118.11 B1.D7
ENABLE
  Bottom 0.203: ATMEGA.2 99.06,24.13 90.17,33.02 6.35,33.02 2.54,36.83 2.54,83.82 26.67,107.95 49.53,107.95 53.09,111.51 B1.D8
GND
  Top 0.61: ATMEGA.1 101.6,17.78 101.6,20.32 102.87,21.59 118.11,21.59 GPA0_GPA5.1
  Top 1.016: INPUTS.1 11.19,73.9 9.9,75.19 9.9,86.07 10.16,86.33 10.16,123.19 C1.- | B1.GND@3 42.42,118.87 REGULATOR_5V.IN-
  Bottom 0.305: IC1.17 66.04,44.45 76.2,34.29 91.44,34.29 101.6,24.13 101.6,17.78 ATMEGA.1
  Bottom 0.508: IC1.17 66.04,46.99 71.12,52.07 IC1.10 71.12,54.61 85.09,68.58 MOSFET4.2
  Bottom 0.61: REGULATOR_5V.OUT- 82.55,128.52 | 82.55,128.52 84.84,128.52 90.17,123.19 MOSFET2.2 | REGULATOR_5V.IN- 67.06,128.52 71.12,124.46 78.49,124.46 82.55,128.52 | C2.2 66.04,59.69 71.12,54.61 | GPB0_GPB5.1 124.52,38.04 124.52,22.88 122.99,21.35 122.95,21.35 121.68,20.08 GPA0_GPA5.1
  Bottom 1.016: MOSFET2.5 114.3,129.03 | 115.95,143.13 114.3,141.48 114.3,129.03 | 115.95,143.13 MOSFET1.5 | MOSFET3.5 114.3,103.63 | 114.3,103.63 114.3,129.03 | MOSFET4.5 114.3,78.23 114.3,103.63 | MOSFET4.2 95.25,73.66 95.25,91.44 | 95.25,91.44 92.71,93.98 MOSFET3.2 | MOSFET2.2 92.71,119.38 95.25,116.84 | 95.25,116.84 95.25,91.44 | 95.25,116.84 95.25,140.97 92.71,143.51 MOSFET1.2 115.57,143.51 115.95,143.13 | J1.GND 19.13,140.89 24.13,135.89 | 24.13,135.89 34.29,135.89 35.56,134.62 LED1.K 37.59,133.35 REGULATOR_5V.IN- | C1.- 12.7,128.27 16.51,128.27 24.13,135.89 | C2.2 63.5,60.96 62.23,62.23 53.34,62.23 52.07,63.5 B1.GND@1 B1.GND@2 | U$1.J1.4 58.42,48.26 IC1.15 IC1.16 IC1.17
  pour Top (isolate 1.016): 146.05,156.21 0,156.21 0,1.27 147.32,1.27 147.32,156.21
  pour Bottom (isolate 1.016): 144.78,154.94 1.27,154.94 1.27,143.51 1.27,1.27 2.54,1.27 146.05,1.27 146.05,154.94
GPA0
  Bottom 0.203: GPA0_GPA5.2 115.56,19.06 99.06,35.56 80.01,35.56 76.2,39.37 IC1.21
GPA1
  Bottom 0.203: IC1.22 86.36,38.1 97.79,38.1 114.3,21.59 116.84,21.59 118.11,20.32 118.11,19.05 119.12,18.04 GPA0_GPA5.3
GPA2
  Top 0.203: IC1.23 87.63,39.37 97.79,39.37 110.49,26.67 117.9,26.67 119.17,25.4 119.17,22.81 120.78,21.2 122.31,21.2 123.19,20.32 123.19,17.78 122.43,17.02 GPA0_GPA5.4
GPA3
  Top 0.203: IC1.24 88.9,40.64 97.79,40.64 110.49,27.94 118.11,27.94 119.53,26.52 119.53,22.96 120.93,21.56 122.87,21.56 124.1,20.32 124.1,17.78 122.32,16 GPA0_GPA5.5
GPA4
  Top 0.203: GPA0_GPA5.6 122.93,14.98 124.46,16.51 124.46,24.9 120.5,28.85 110.85,28.85 97.79,41.91 88.9,41.91 86.36,44.45 IC1.25
GPA5
  Top 0.203: IC1.26 91.44,43.18 97.79,43.18 111.76,29.21 120.65,29.21 125.32,24.54 125.32,16.1 123.18,13.96 GPA0_GPA5.7
GPB0
  Bottom 0.152: IC1.1 93.98,52.07 104.13,41.92 GPB0_GPB5.2
GPB1
  Bottom 0.152: IC1.2 95.3,49.48 95.32,49.48 103.9,40.9 GPB0_GPB5.3
GPB2
  Bottom 0.152: IC1.3 88.9,50.8 90.53,49.17 95.2,49.17 104.49,39.88 GPB0_GPB5.4
GPB3
  Bottom 0.152: IC1.4 86.36,50.8 88.29,48.87 95.07,48.87 105.08,38.86 GPB0_GPB5.5
GPB4
  Bottom 0.152: IC1.5 83.82,50.8 86.06,48.56 94.95,48.56 105.67,37.84 GPB0_GPB5.6
GPB5
  Bottom 0.152: GPB0_GPB5.7 105.42,36.82 93.98,48.26 82.55,48.26 81.28,49.53 IC1.6
IN1
  Bottom 0.254: INPUTS.2 58.43,74.92 62.23,71.12 B1.A0
IN2
  Bottom 0.254: INPUTS.3 61.22,75.94 64.77,72.39 B1.A1
IN3
  Bottom 0.254: INPUTS.4 62.74,76.96 67.31,72.39 B1.A2
IN4
  Bottom 0.254: INPUTS.5 62.99,77.98 69.85,71.12 B1.A3
IN5
  Bottom 0.254: INPUTS.6 49.79,79 69.85,99.06 B1.D2
IN6
  Bottom 0.254: B1.D4 64.77,96.52 48.27,80.02 INPUTS.7
N$1
  Bottom 1.016: J1.PWR 12.43,132.08 10.16,132.08 5.08,137.16 5.08,140.97 13.97,149.86 25.4,149.86 29.21,146.05 ON_OFF_SWITCH.2
N$2
  Bottom 1.016: R1.1 33.02,127 LED1.A
N$11
  Bottom 0.305: LCD1.16 50.55,44.2 U$1.J2.16
N$12
  Bottom 0.305: LCD1.15 48.01,44.2 U$1.J2.15
N$13
  Bottom 0.305: LCD1.14 45.47,44.2 U$1.J2.14
N$14
  Bottom 0.305: LCD1.13 42.93,44.2 U$1.J2.13
N$24
  Bottom 0.305: LCD1.12 40.39,44.2 U$1.J2.12
N$25
  Bottom 0.305: LCD1.11 37.85,44.2 U$1.J2.11
N$26
  Bottom 0.305: LCD1.10 35.31,44.2 U$1.J2.10
N$27
  Bottom 0.305: LCD1.9 32.77,44.2 U$1.J2.9
N$28
  Bottom 0.305: LCD1.8 30.23,44.2 U$1.J2.8
N$29
  Bottom 0.305: LCD1.7 27.69,44.2 U$1.J2.7
N$30
  Bottom 0.305: LCD1.6 25.15,44.2 U$1.J2.6
N$31
  Bottom 0.305: LCD1.5 22.61,44.2 U$1.J2.5
N$32
  Bottom 0.305: LCD1.4 20.07,44.2 U$1.J2.4
N$33
  Bottom 0.305: LCD1.3 17.53,44.2 U$1.J2.3
N$34
  Bottom 0.305: LCD1.2 14.99,44.2 U$1.J2.2
N$35
  Bottom 0.305: LCD1.1 12.45,44.2 U$1.J2.1
OUT1_+
  Top 1.016: VCC_MOSFET1.2 102.87,133.35 106.68,137.16 MOSFET1.3
  Bottom 1.016: MOSFET1.3 OUT_MOSFET1.1
OUT1_LOAD
  Bottom 1.016: MOSFET1.4 OUT_MOSFET1.2
OUT2_+
  Top 1.016: VCC_MOSFET2.2 102.87,109.22 106.68,113.03 MOSFET2.3
  Bottom 1.016: MOSFET2.3 OUT_MOSFET2.1
OUT2_LOAD
  Bottom 1.016: MOSFET2.4 OUT_MOSFET2.2
OUT3_+
  Top 1.016: VCC_MOSFET3.2 102.87,83.82 106.68,87.63 MOSFET3.3
  Bottom 1.016: MOSFET3.3 OUT_MOSFET3.1
OUT3_LOAD
  Bottom 1.016: MOSFET3.4 OUT_MOSFET3.2
OUT4_+
  Top 1.016: VCC_MOSFET4.2 102.87,57.15 107.95,62.23 MOSFET4.3
  Bottom 1.016: MOSFET4.3 OUT_MOSFET4.1
OUT4_LOAD
  Bottom 1.016: MOSFET4.4 OUT_MOSFET4.2
PWM1
  Top 0.305: B1.D3 67.31,127 63.5,130.81 49.53,130.81 38.1,142.24 38.1,148.59 40.64,151.13 82.55,151.13 87.63,146.05 87.63,142.24 88.9,140.97 MOSFET1.1
PWM2
  Bottom 0.305: B1.D5 64.77,116.84 MOSFET2.1
PWM3
  Top 0.203: 77.56,102.87 82.55,97.88 82.55,93.98 85.09,91.44 87.63,91.44
  Top 0.305: B1.D6 59.69,113.03 69.85,102.87 77.56,102.87 | 87.63,91.44 MOSFET3.1
PWM4
  Top 0.203: MOSFET4.1 86.36,66.04 81.28,71.12 81.28,78.74 50.55,109.47 B1.D9
RESET
  Top 0.254: B1.RESET@1 62.23,48.26 67.31,48.26 68.58,46.99 IC1.18
SCL
  Top 0.203: U$1.J1.3 39.37,50.8 29.21,60.96 29.21,113.01 30.23,114.03 B1.SCL
  Bottom 0.203: U$1.J1.3 54.61,50.8 55.88,49.53 64.77,49.53 66.04,50.8 IC1.12
SDA
  Top 0.203: U$1.J1.2 41.91,53.34 32.77,62.48 B1.SDA
  Bottom 0.203: U$1.J1.2 54.61,53.34 57.15,50.8 62.23,50.8 63.5,52.07 IC1.13

### Text on the board
Top: + | 5V COM 12V | + | 5V COM 12V | + | 5V COM 12V | + | 5V COM 12V | 1.GND / 8.5V | 1.GND / 8.5V